# Altium schematic sheet FPGA_QDRII.SchDoc
size A3
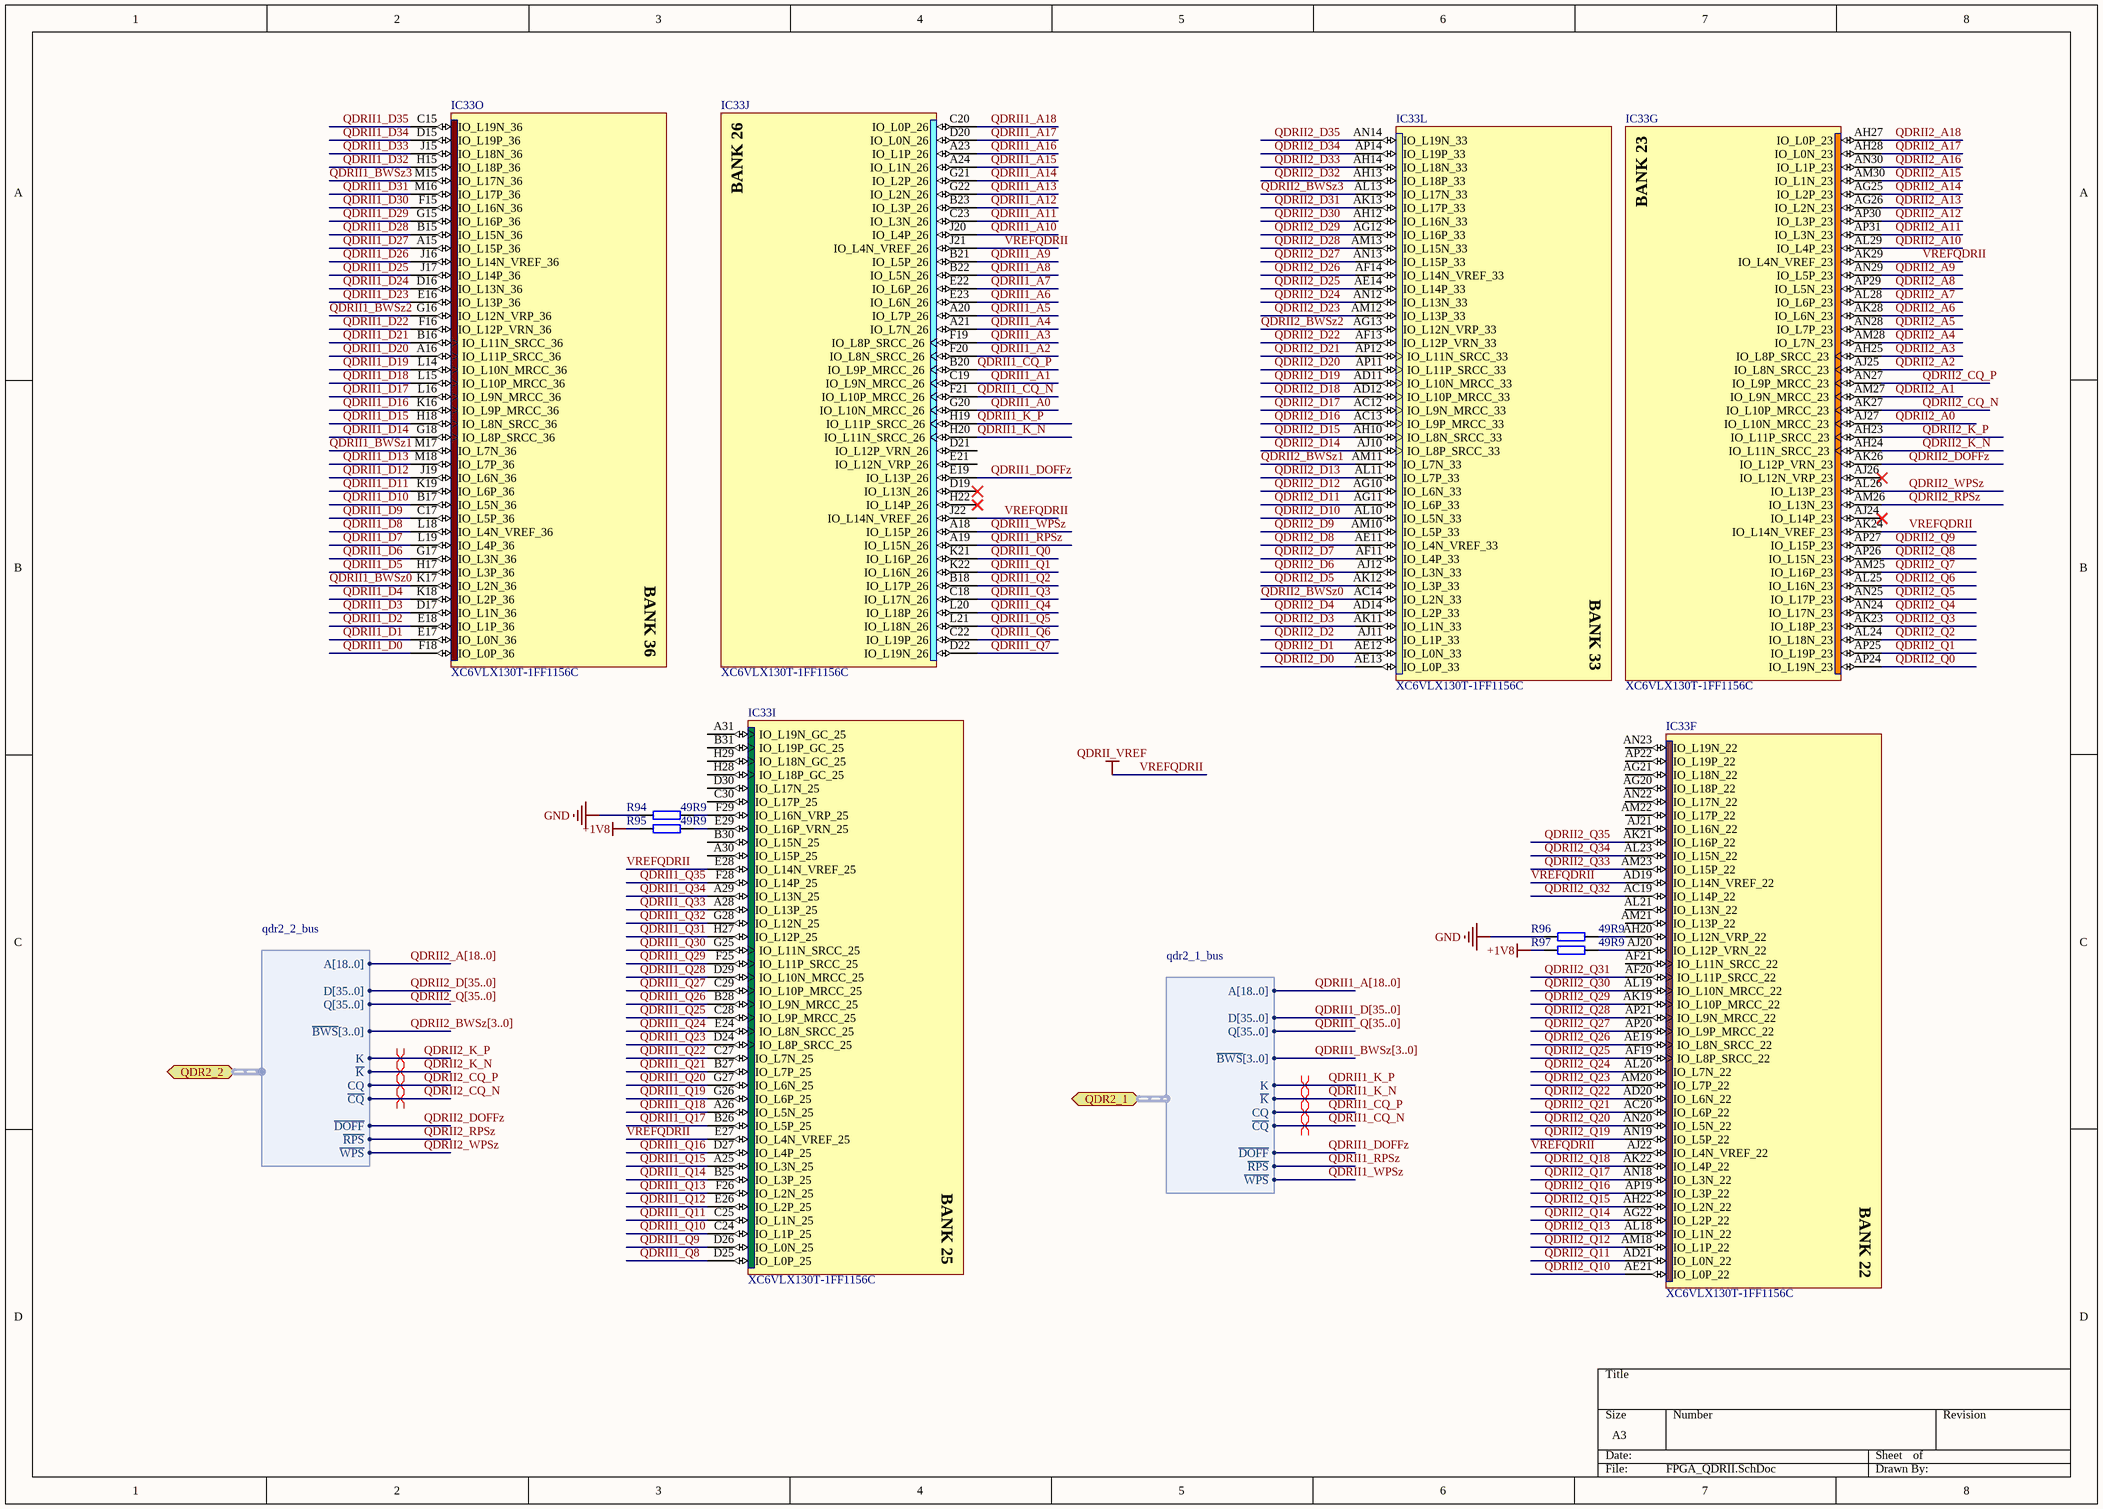
[diagram p0: FPGA_QDRII.SchDoc]

## Parts
IC33  XC6VLX130T-1FF1156C  [FF1156]  (parts F,G,I,J,L,O of 20)
R94  49R9  [0402]
R95  49R9  [0402]
R96  49R9  [0402]
R97  49R9  [0402]

## Ports
QDR2_1 (harness qdr2_1_bus), QDR2_2 (harness qdr2_2_bus)

## Harnesses
qdr2_1_bus: A[18..0], ~{BWS}[3..0], ~{CQ}, CQ, D[35..0], ~{DOFF}, K, ~{K}, Q[35..0], ~{RPS}, ~{WPS}
qdr2_2_bus: A[18..0], ~{BWS}[3..0], ~{CQ}, CQ, D[35..0], ~{DOFF}, K, ~{K}, Q[35..0], ~{RPS}, ~{WPS}

## Nets
+1V8: R95.2 R97.2
GND: R94.2 R96.2
VREFQDRII: IC33.AD19(IO_L14N_VREF_22) IC33.AJ22(IO_L4N_VREF_22) IC33.AK24(IO_L14N_VREF_23) IC33.AK29(IO_L4N_VREF_23) IC33.E27(IO_L4N_VREF_25) IC33.E28(IO_L14N_VREF_25) IC33.J21(IO_L4N_VREF_26) IC33.J22(IO_L14N_VREF_26)  [also labelled QDRII_VREF]
QDRII1_A0: IC33.G20(IO_L10N_MRCC_26)
QDRII1_A1: IC33.C19(IO_L9N_MRCC_26)
QDRII1_A2: IC33.F20(IO_L8N_SRCC_26)
QDRII1_A3: IC33.F19(IO_L8P_SRCC_26)
QDRII1_A4: IC33.A21(IO_L7N_26)
QDRII1_A5: IC33.A20(IO_L7P_26)
QDRII1_A6: IC33.E23(IO_L6N_26)
QDRII1_A7: IC33.E22(IO_L6P_26)
QDRII1_A8: IC33.B22(IO_L5N_26)
QDRII1_A9: IC33.B21(IO_L5P_26)
QDRII1_A10: IC33.J20(IO_L4P_26)
QDRII1_A11: IC33.C23(IO_L3N_26)
QDRII1_A12: IC33.B23(IO_L3P_26)
QDRII1_A13: IC33.G22(IO_L2N_26)
QDRII1_A14: IC33.G21(IO_L2P_26)
QDRII1_A15: IC33.A24(IO_L1N_26)
QDRII1_A16: IC33.A23(IO_L1P_26)
QDRII1_A17: IC33.D20(IO_L0N_26)
QDRII1_A18: IC33.C20(IO_L0P_26)
QDRII1_BWSz0: IC33.K17(IO_L2N_36)
QDRII1_BWSz1: IC33.M17(IO_L7N_36)
QDRII1_BWSz2: IC33.G16(IO_L12N_VRP_36)
QDRII1_BWSz3: IC33.M15(IO_L17N_36)
QDRII1_CQ_N: IC33.F21(IO_L10P_MRCC_26) ; port QDR2_1.~{CQ}
QDRII1_CQ_P: IC33.B20(IO_L9P_MRCC_26) ; port QDR2_1.CQ
QDRII1_D0: IC33.F18(IO_L0P_36)
QDRII1_D1: IC33.E17(IO_L0N_36)
QDRII1_D2: IC33.E18(IO_L1P_36)
QDRII1_D3: IC33.D17(IO_L1N_36)
QDRII1_D4: IC33.K18(IO_L2P_36)
QDRII1_D5: IC33.H17(IO_L3P_36)
QDRII1_D6: IC33.G17(IO_L3N_36)
QDRII1_D7: IC33.L19(IO_L4P_36)
QDRII1_D8: IC33.L18(IO_L4N_VREF_36)
QDRII1_D9: IC33.C17(IO_L5P_36)
QDRII1_D10: IC33.B17(IO_L5N_36)
QDRII1_D11: IC33.K19(IO_L6P_36)
QDRII1_D12: IC33.J19(IO_L6N_36)
QDRII1_D13: IC33.M18(IO_L7P_36)
QDRII1_D14: IC33.G18(IO_L8P_SRCC_36)
QDRII1_D15: IC33.H18(IO_L8N_SRCC_36)
QDRII1_D16: IC33.K16(IO_L9P_MRCC_36)
QDRII1_D17: IC33.L16(IO_L9N_MRCC_36)
QDRII1_D18: IC33.L15(IO_L10P_MRCC_36)
QDRII1_D19: IC33.L14(IO_L10N_MRCC_36)
QDRII1_D20: IC33.A16(IO_L11P_SRCC_36)
QDRII1_D21: IC33.B16(IO_L11N_SRCC_36)
QDRII1_D22: IC33.F16(IO_L12P_VRN_36)
QDRII1_D23: IC33.E16(IO_L13P_36)
QDRII1_D24: IC33.D16(IO_L13N_36)
QDRII1_D25: IC33.J17(IO_L14P_36)
QDRII1_D26: IC33.J16(IO_L14N_VREF_36)
QDRII1_D27: IC33.A15(IO_L15P_36)
QDRII1_D28: IC33.B15(IO_L15N_36)
QDRII1_D29: IC33.G15(IO_L16P_36)
QDRII1_D30: IC33.F15(IO_L16N_36)
QDRII1_D31: IC33.M16(IO_L17P_36)
QDRII1_D32: IC33.H15(IO_L18P_36)
QDRII1_D33: IC33.J15(IO_L18N_36)
QDRII1_D34: IC33.D15(IO_L19P_36)
QDRII1_D35: IC33.C15(IO_L19N_36)
QDRII1_DOFFz: IC33.E19(IO_L13P_26) ; port QDR2_1.~{DOFF}
QDRII1_K_N: IC33.H20(IO_L11N_SRCC_26) ; port QDR2_1.~{K}
QDRII1_K_P: IC33.H19(IO_L11P_SRCC_26) ; port QDR2_1.K
QDRII1_Q0: IC33.K21(IO_L16P_26)
QDRII1_Q1: IC33.K22(IO_L16N_26)
QDRII1_Q2: IC33.B18(IO_L17P_26)
QDRII1_Q3: IC33.C18(IO_L17N_26)
QDRII1_Q4: IC33.L20(IO_L18P_26)
QDRII1_Q5: IC33.L21(IO_L18N_26)
QDRII1_Q6: IC33.C22(IO_L19P_26)
QDRII1_Q7: IC33.D22(IO_L19N_26)
QDRII1_Q8: IC33.D25(IO_L0P_25)
QDRII1_Q9: IC33.D26(IO_L0N_25)
QDRII1_Q10: IC33.C24(IO_L1P_25)
QDRII1_Q11: IC33.C25(IO_L1N_25)
QDRII1_Q12: IC33.E26(IO_L2P_25)
QDRII1_Q13: IC33.F26(IO_L2N_25)
QDRII1_Q14: IC33.B25(IO_L3P_25)
QDRII1_Q15: IC33.A25(IO_L3N_25)
QDRII1_Q16: IC33.D27(IO_L4P_25)
QDRII1_Q17: IC33.B26(IO_L5P_25)
QDRII1_Q18: IC33.A26(IO_L5N_25)
QDRII1_Q19: IC33.G26(IO_L6P_25)
QDRII1_Q20: IC33.G27(IO_L6N_25)
QDRII1_Q21: IC33.B27(IO_L7P_25)
QDRII1_Q22: IC33.C27(IO_L7N_25)
QDRII1_Q23: IC33.D24(IO_L8P_SRCC_25)
QDRII1_Q24: IC33.E24(IO_L8N_SRCC_25)
QDRII1_Q25: IC33.C28(IO_L9P_MRCC_25)
QDRII1_Q26: IC33.B28(IO_L9N_MRCC_25)
QDRII1_Q27: IC33.C29(IO_L10P_MRCC_25)
QDRII1_Q28: IC33.D29(IO_L10N_MRCC_25)
QDRII1_Q29: IC33.F25(IO_L11P_SRCC_25)
QDRII1_Q30: IC33.G25(IO_L11N_SRCC_25)
QDRII1_Q31: IC33.H27(IO_L12P_25)
QDRII1_Q32: IC33.G28(IO_L12N_25)
QDRII1_Q33: IC33.A28(IO_L13P_25)
QDRII1_Q34: IC33.A29(IO_L13N_25)
QDRII1_Q35: IC33.F28(IO_L14P_25)
QDRII1_RPSz: IC33.A19(IO_L15N_26) ; port QDR2_1.~{RPS}
QDRII1_WPSz: IC33.A18(IO_L15P_26) ; port QDR2_1.~{WPS}
QDRII2_A0: IC33.AJ27(IO_L10N_MRCC_23)
QDRII2_A1: IC33.AM27(IO_L9N_MRCC_23)
QDRII2_A2: IC33.AJ25(IO_L8N_SRCC_23)
QDRII2_A3: IC33.AH25(IO_L8P_SRCC_23)
QDRII2_A4: IC33.AM28(IO_L7N_23)
QDRII2_A5: IC33.AN28(IO_L7P_23)
QDRII2_A6: IC33.AK28(IO_L6N_23)
QDRII2_A7: IC33.AL28(IO_L6P_23)
QDRII2_A8: IC33.AP29(IO_L5N_23)
QDRII2_A9: IC33.AN29(IO_L5P_23)
QDRII2_A10: IC33.AL29(IO_L4P_23)
QDRII2_A11: IC33.AP31(IO_L3N_23)
QDRII2_A12: IC33.AP30(IO_L3P_23)
QDRII2_A13: IC33.AG26(IO_L2N_23)
QDRII2_A14: IC33.AG25(IO_L2P_23)
QDRII2_A15: IC33.AM30(IO_L1N_23)
QDRII2_A16: IC33.AN30(IO_L1P_23)
QDRII2_A17: IC33.AH28(IO_L0N_23)
QDRII2_A18: IC33.AH27(IO_L0P_23)
QDRII2_BWSz0: IC33.AC14(IO_L2N_33)
QDRII2_BWSz1: IC33.AM11(IO_L7N_33)
QDRII2_BWSz2: IC33.AG13(IO_L12N_VRP_33)
QDRII2_BWSz3: IC33.AL13(IO_L17N_33)
QDRII2_CQ_N: IC33.AK27(IO_L10P_MRCC_23) ; port QDR2_2.~{CQ}
QDRII2_CQ_P: IC33.AN27(IO_L9P_MRCC_23) ; port QDR2_2.CQ
QDRII2_D0: IC33.AE13(IO_L0P_33)
QDRII2_D1: IC33.AE12(IO_L0N_33)
QDRII2_D2: IC33.AJ11(IO_L1P_33)
QDRII2_D3: IC33.AK11(IO_L1N_33)
QDRII2_D4: IC33.AD14(IO_L2P_33)
QDRII2_D5: IC33.AK12(IO_L3P_33)
QDRII2_D6: IC33.AJ12(IO_L3N_33)
QDRII2_D7: IC33.AF11(IO_L4P_33)
QDRII2_D8: IC33.AE11(IO_L4N_VREF_33)
QDRII2_D9: IC33.AM10(IO_L5P_33)
QDRII2_D10: IC33.AL10(IO_L5N_33)
QDRII2_D11: IC33.AG11(IO_L6P_33)
QDRII2_D12: IC33.AG10(IO_L6N_33)
QDRII2_D13: IC33.AL11(IO_L7P_33)
QDRII2_D14: IC33.AJ10(IO_L8P_SRCC_33)
QDRII2_D15: IC33.AH10(IO_L8N_SRCC_33)
QDRII2_D16: IC33.AC13(IO_L9P_MRCC_33)
QDRII2_D17: IC33.AC12(IO_L9N_MRCC_33)
QDRII2_D18: IC33.AD12(IO_L10P_MRCC_33)
QDRII2_D19: IC33.AD11(IO_L10N_MRCC_33)
QDRII2_D20: IC33.AP11(IO_L11P_SRCC_33)
QDRII2_D21: IC33.AP12(IO_L11N_SRCC_33)
QDRII2_D22: IC33.AF13(IO_L12P_VRN_33)
QDRII2_D23: IC33.AM12(IO_L13P_33)
QDRII2_D24: IC33.AN12(IO_L13N_33)
QDRII2_D25: IC33.AE14(IO_L14P_33)
QDRII2_D26: IC33.AF14(IO_L14N_VREF_33)
QDRII2_D27: IC33.AN13(IO_L15P_33)
QDRII2_D28: IC33.AM13(IO_L15N_33)
QDRII2_D29: IC33.AG12(IO_L16P_33)
QDRII2_D30: IC33.AH12(IO_L16N_33)
QDRII2_D31: IC33.AK13(IO_L17P_33)
QDRII2_D32: IC33.AH13(IO_L18P_33)
QDRII2_D33: IC33.AH14(IO_L18N_33)
QDRII2_D34: IC33.AP14(IO_L19P_33)
QDRII2_D35: IC33.AN14(IO_L19N_33)
QDRII2_DOFFz: IC33.AK26(IO_L12P_VRN_23) ; port QDR2_2.~{DOFF}
QDRII2_K_N: IC33.AH24(IO_L11N_SRCC_23) ; port QDR2_2.~{K}
QDRII2_K_P: IC33.AH23(IO_L11P_SRCC_23) ; port QDR2_2.K
QDRII2_Q0: IC33.AP24(IO_L19N_23)
QDRII2_Q1: IC33.AP25(IO_L19P_23)
QDRII2_Q2: IC33.AL24(IO_L18N_23)
QDRII2_Q3: IC33.AK23(IO_L18P_23)
QDRII2_Q4: IC33.AN24(IO_L17N_23)
QDRII2_Q5: IC33.AN25(IO_L17P_23)
QDRII2_Q6: IC33.AL25(IO_L16N_23)
QDRII2_Q7: IC33.AM25(IO_L16P_23)
QDRII2_Q8: IC33.AP26(IO_L15N_23)
QDRII2_Q9: IC33.AP27(IO_L15P_23)
QDRII2_Q10: IC33.AE21(IO_L0P_22)
QDRII2_Q11: IC33.AD21(IO_L0N_22)
QDRII2_Q12: IC33.AM18(IO_L1P_22)
QDRII2_Q13: IC33.AL18(IO_L1N_22)
QDRII2_Q14: IC33.AG22(IO_L2P_22)
QDRII2_Q15: IC33.AH22(IO_L2N_22)
QDRII2_Q16: IC33.AP19(IO_L3P_22)
QDRII2_Q17: IC33.AN18(IO_L3N_22)
QDRII2_Q18: IC33.AK22(IO_L4P_22)
QDRII2_Q19: IC33.AN19(IO_L5P_22)
QDRII2_Q20: IC33.AN20(IO_L5N_22)
QDRII2_Q21: IC33.AC20(IO_L6P_22)
QDRII2_Q22: IC33.AD20(IO_L6N_22)
QDRII2_Q23: IC33.AM20(IO_L7P_22)
QDRII2_Q24: IC33.AL20(IO_L7N_22)
QDRII2_Q25: IC33.AF19(IO_L8P_SRCC_22)
QDRII2_Q26: IC33.AE19(IO_L8N_SRCC_22)
QDRII2_Q27: IC33.AP20(IO_L9P_MRCC_22)
QDRII2_Q28: IC33.AP21(IO_L9N_MRCC_22)
QDRII2_Q29: IC33.AK19(IO_L10P_MRCC_22)
QDRII2_Q30: IC33.AL19(IO_L10N_MRCC_22)
QDRII2_Q31: IC33.AF20(IO_L11P_SRCC_22)
QDRII2_Q32: IC33.AC19(IO_L14P_22)
QDRII2_Q33: IC33.AM23(IO_L15P_22)
QDRII2_Q34: IC33.AL23(IO_L15N_22)
QDRII2_Q35: IC33.AK21(IO_L16P_22)
QDRII2_RPSz: IC33.AM26(IO_L13N_23) ; port QDR2_2.~{RPS}
QDRII2_WPSz: IC33.AL26(IO_L13P_23) ; port QDR2_2.~{WPS}
NetIC33_AH20: IC33.AH20(IO_L12N_VRP_22) R96.1
NetIC33_AJ20: IC33.AJ20(IO_L12P_VRN_22) R97.1
NetIC33_E29: IC33.E29(IO_L16P_VRN_25) R95.1
NetIC33_F29: IC33.F29(IO_L16N_VRP_25) R94.1

Not connected (* = marked no-connect by the designer): IC33 A30(IO_L15P_25) A31(IO_L19N_GC_25) AF21(IO_L11N_SRCC_22) AG20(IO_L18P_22) AG21(IO_L18N_22) AJ21(IO_L16N_22) AJ24(IO_L14P_23)* AJ26(IO_L12N_VRP_23)* AL21(IO_L13N_22) AM21(IO_L13P_22) AM22(IO_L17P_22) AN22(IO_L17N_22) AN23(IO_L19N_22) AP22(IO_L19P_22) B30(IO_L15N_25) B31(IO_L19P_GC_25) C30(IO_L17P_25) D19(IO_L13N_26)* D21(IO_L12P_VRN_26) D30(IO_L17N_25) E21(IO_L12N_VRP_26) H22(IO_L14P_26)* H28(IO_L18P_GC_25) H29(IO_L18N_GC_25)

## Buses and harness runs
bus QDRII1_A[18..0]
bus QDRII1_BWSz[3..0]
bus QDRII1_D[35..0]
bus QDRII1_Q[35..0]
bus QDRII2_A[18..0]
bus QDRII2_BWSz[3..0]
bus QDRII2_D[35..0]
bus QDRII2_Q[35..0]

## Layout directives
differential pair: QDRII1_CQ_N, QDRII1_CQ_P, QDRII1_K_N, QDRII1_K_P, QDRII2_CQ_N, QDRII2_CQ_P, QDRII2_K_N, QDRII2_K_P

## Notes on the sheet
- (in symbol XC6VLX130T-1FF1156C, part F) BANK 22
- (in symbol XC6VLX130T-1FF1156C, part G) BANK 23
- (in symbol XC6VLX130T-1FF1156C, part I) BANK 25
- (in symbol XC6VLX130T-1FF1156C, part J) BANK 26
- (in symbol XC6VLX130T-1FF1156C, part L) BANK 33
- (in symbol XC6VLX130T-1FF1156C, part O) BANK 36

## Library data of the parts
IC33 = XC6VLX130T-1FF1156C: Virtex-6 LXT Platform FPGA, 600 User I/Os, 20 GTXs, 1156-Ball FFBGA, Speed Grade 1, Commercial Grade; FirstPublished: 17-Nov-2009; DatasheetVersion: v2.0, Sep-2009; PackageVersion: ver1.0, Jun-2009; PackageReference: FF1156; Publisher: Altium Limited; PackageDescription: 1156-Ball Flip-Chip Fine Pitch Ball Grid Array (FF1156); Code_JEDEC: MS-034-AAR-1; Code_IPC: BGA100P34X34-1156; ComponentLink1Description: Virtex-6 Datasheet; ComponentLink1URL: http://www.xilinx.com/support/documentation/data_sheets/ds150.pdf; ComponentLink2Description: Pinout Specification; ComponentLink2URL: http://www.xilinx.com/support/packagefiles/virtex-6-pkgs.htm; ComponentLink3Description: FF1156 Package Drawing; ComponentLink3URL: http://www.xilinx.com/support/documentation/package_specs/ff1156.pdf; ComponentLink4Description: Virtex-6 Documents; ComponentLink4URL: http://www.xilinx.com/support/documentation/virtex-6.htm; ComponentLink5Description: Xilinx.com Home; ComponentLink5URL: http://www.xilinx.com
R94-R97 = R0402_49R9_±1%_0.1W_100PPM: SMD Resistor; Manufacturer1: Panasonic; Manufacturer1 PN: ERJ-2RKF49R9X; TCR: 100ppm; Power Rating: 0.1W; Tolerance: ±1%; Case: 0402; Distributor1: DigiKey; Distributor1 PN: P49.9LCT-ND; Value: 49R9